# EAGLE schematic mother_card_cs_1159am (EAGLE 8.3.2)

## Sheet 1 of 2
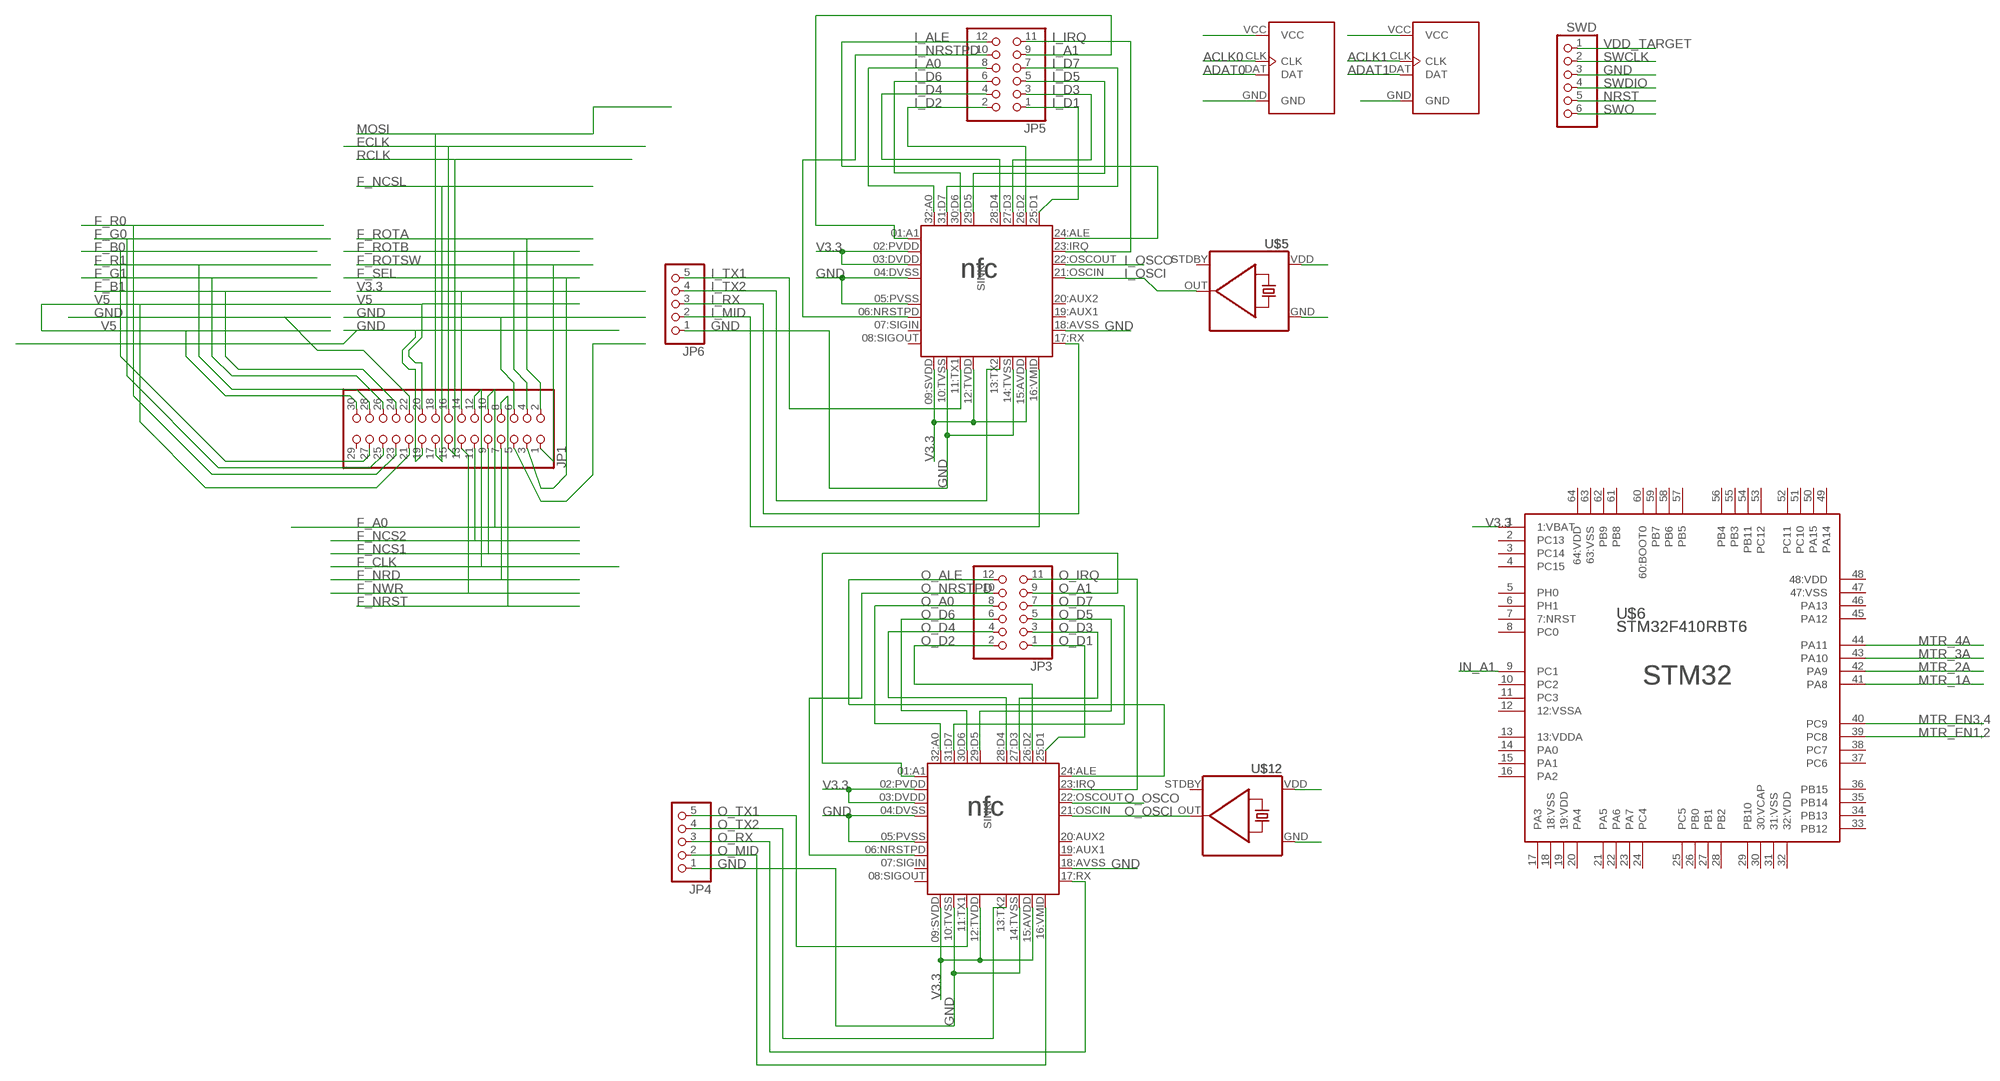
[diagram p0: schematic, sheet 1]

### Parts
JP1  PINHD-2X15/SOCK  [2X15/SOCK]
JP3  PINHD-2X6  [2X06]
JP4  PINHD-1X5  [1X05]
JP5  PINHD-2X6  [2X06]
JP6  PINHD-1X5  [1X05]
SWD  PINHD-1X6  [1X06]
U$1  HX711  [HX711]
U$2  HX711  [HX711]
U$3  PN215_NFC  [PN512_32_5X5]
U$5  DSC1033_27.12MHZ  [DSC1033_5X3.2]
U$6  STM32F410RBT6  [QFP50P1200X1200X160-64N]
U$11  PN215_NFC  [PN512_32_5X5]
U$12  DSC1033_27.12MHZ  [DSC1033_5X3.2]

### Nets
3V3B: JP1.5
ACLK0: U$1.CLK
ACLK1: U$2.CLK
ADAT0: U$1.DAT
ADAT1: U$2.DAT
ECLK: JP1.16
F_A0: JP1.10
F_B0: JP1.27
F_B1: JP1.24
F_CLK: JP1.12
F_G0: JP1.25
F_G1: JP1.26
F_NCS1: JP1.9
F_NCS2: JP1.11
F_NCSL: JP1.17
F_NRD: JP1.7
F_NRST: JP1.8
F_NWR: JP1.13
F_R0: JP1.23
F_R1: JP1.28
F_ROTA: JP1.2
F_ROTB: JP1.4
F_ROTSW: JP1.1
F_SEL: JP1.3
GND: JP1.6 JP1.19 JP1.22 JP6.1 SWD.3 U$3.04:DVSS U$3.05:PVSS U$3.10:TVSS U$3.14:TVSS U$3.18:AVSS U$5.GND U$11.04:DVSS U$11.05:PVSS U$11.10:TVSS U$11.14:TVSS U$11.18:AVSS U$12.GND ; also sheet 2
I_A0: JP5.8 U$11.32:A0
I_A1: JP5.9 U$11.01:A1
I_ALE: JP5.12 U$11.24:ALE
I_D1: JP5.1 U$11.25:D1
I_D2: JP5.2 U$11.26:D2
I_D3: JP5.3 U$11.27:D3
I_D4: JP5.4 U$11.28:D4
I_D5: JP5.5 U$11.29:D5
I_D6: JP5.6 U$11.30:D6
I_D7: JP5.7 U$11.31:D7
I_IRQ: JP5.11 U$11.23:IRQ
I_MID: JP6.2 U$11.16:VMID
I_NRSTPD: JP5.10 U$11.06:NRSTPD
I_OSCI: U$5.OUT(FO) U$11.21:OSCIN
I_OSCO: U$11.22:OSCOUT
I_RX: JP6.3 U$11.17:RX
I_TX1: JP6.5 U$11.11:TX1
I_TX2: JP6.4 U$11.13:TX2
IN_A1: U$6.9(PC1)
MOSI: JP1.18
MTR_1A: U$6.41(PA8) ; also sheet 2
MTR_2A: U$6.42(PA9) ; also sheet 2
MTR_3A: U$6.43(PA10) ; also sheet 2
MTR_4A: U$6.44(PA11) ; also sheet 2
MTR_EN1,2: U$6.39(PC8) ; also sheet 2
MTR_EN3,4: U$6.40(PC9) ; also sheet 2
N$6: U$1.GND
N$7: U$2.GND
N$8: U$2.VCC
N$9: U$1.VCC
NRST: SWD.5
O_A0: JP3.8 U$3.32:A0
O_A1: JP3.9 U$3.01:A1
O_ALE: JP3.12 U$3.24:ALE
O_D1: JP3.1 U$3.25:D1
O_D2: JP3.2 U$3.26:D2
O_D3: JP3.3 U$3.27:D3
O_D4: JP3.4 U$3.28:D4
O_D5: JP3.5 U$3.29:D5
O_D6: JP3.6 U$3.30:D6
O_D7: JP3.7 U$3.31:D7
O_IRQ: JP3.11 U$3.23:IRQ
O_MID: U$3.16:VMID
O_NRSTPD: JP3.10 U$3.06:NRSTPD
O_OSCI: U$3.21:OSCIN U$12.OUT(FO)
O_OSCO: U$3.22:OSCOUT
O_RX: U$3.17:RX
O_TX1: U$3.11:TX1
O_TX2: U$3.13:TX2
RCLK: JP1.15
SWCLK: SWD.2
SWDIO: SWD.4
SWO: SWD.6
V3.3: JP1.14 U$3.02:PVDD U$3.03:DVDD U$3.09:SVDD U$3.12:TVDD U$3.15:AVDD U$5.VDD(VCC) U$6.1(1:VBAT) U$11.02:PVDD U$11.03:DVDD U$11.09:SVDD U$11.12:TVDD U$11.15:AVDD U$12.VDD(VCC) ; also sheet 2
V5: JP1.20 JP1.21 JP1.30 ; also sheet 2
VDD_TARGET: SWD.1
Unconnected: JP1.29 JP4.1 JP4.2 JP4.3 JP4.4 JP4.5 U$3.07:SIGIN U$3.08:SIGOUT U$3.19:AUX1 U$3.20:AUX2 U$5.STDBY U$6.2(PC13) U$6.3(PC14) U$6.4(PC15) U$6.5(PH0) U$6.6(PH1) U$6.7(7:NRST) U$6.8(PC0) U$6.10(PC2) U$6.11(PC3) U$6.12(12:VSSA) U$6.13(13:VDDA) U$6.14(PA0) U$6.15(PA1) U$6.16(PA2) U$6.17(PA3) U$6.18(18:VSS) U$6.19(19:VDD) U$6.20(PA4) U$6.21(PA5) U$6.22(PA6) U$6.23(PA7) U$6.24(PC4) U$6.25(PC5) U$6.26(PB0) U$6.27(PB1) U$6.28(PB2) U$6.29(PB10) U$6.30(30:VCAP) U$6.31(31:VSS) U$6.32(32:VDD) U$6.33(PB12) U$6.34(PB13) U$6.35(PB14) U$6.36(PB15) U$6.37(PC6) U$6.38(PC7) U$6.45(PA12) U$6.46(PA13) U$6.47(47:VSS) U$6.48(48:VDD) U$6.49(PA14) U$6.50(PA15) U$6.51(PC10) U$6.52(PC11) U$6.53(PC12) U$6.54(PB11) U$6.55(PB3) U$6.56(PB4) U$6.57(PB5) U$6.58(PB6) U$6.59(PB7) U$6.60(60:BOOT0) U$6.61(PB8) U$6.62(PB9) U$6.63(63:VSS) U$6.64(64:VDD) U$11.07:SIGIN U$11.08:SIGOUT U$11.19:AUX1 U$11.20:AUX2 U$12.STDBY

## Sheet 2 of 2
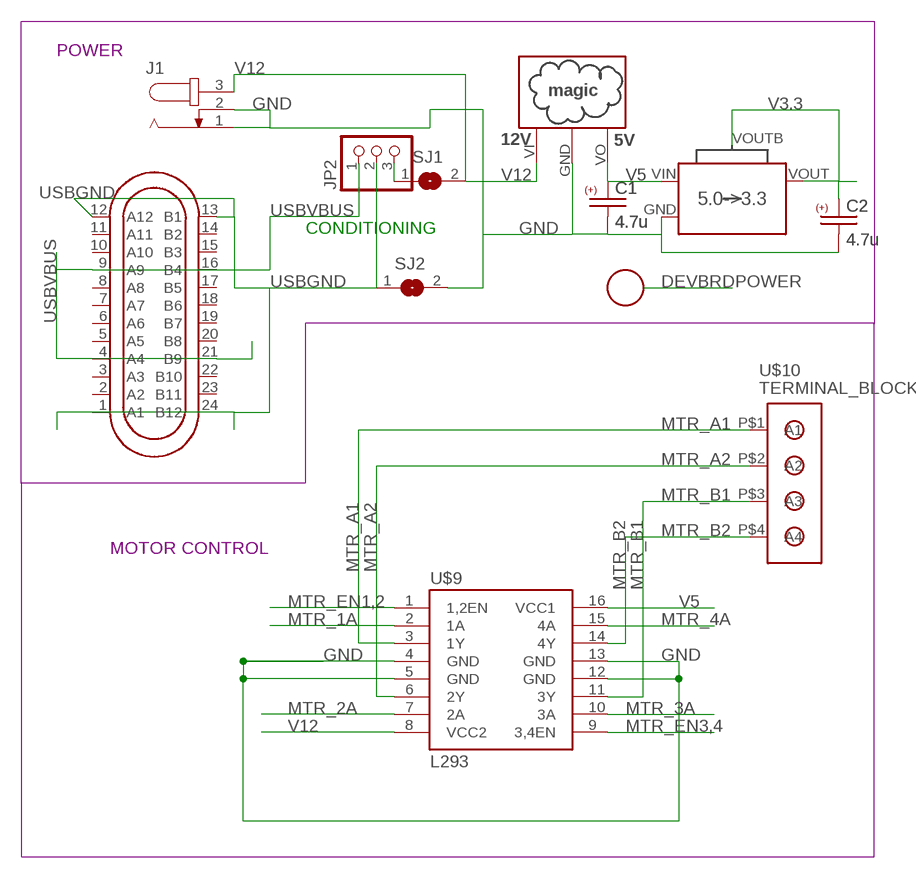
[diagram p1: schematic, sheet 2]

### Parts
C1  4.7u  C-USC0805  [C0805]
C2  4.7u  C-USC0805  [C0805]
J1  JACK-PLUG0  [SPC4077]
JP2  PINHD-1X3  [1X03]
SJ1  SJ  [SJ]
SJ2  SJ  [SJ]
U$4  OKI-78SR-W36  [SIP3]
U$7  USB-C-BRKOUT  [USB-C-BRKOUT]
U$8  AP2114H  [AP2114H]
U$9  L293  [DIL16]
U$10  TERMINAL_BLOCK  [1X4/BLOCK]

### Nets
GND: C1.2 C2.2 J1.1 J1.2 SJ2.2 U$4.GND U$8.GND U$9.4(GND) U$9.5(GND) U$9.12(GND) U$9.13(GND) ; also sheet 1
MTR_1A: U$9.2(1A) ; also sheet 1
MTR_2A: U$9.7(2A) ; also sheet 1
MTR_3A: U$9.10(3A) ; also sheet 1
MTR_4A: U$9.15(4A) ; also sheet 1
MTR_A1: U$9.3(1Y) U$10.P$1(A1)
MTR_A2: U$9.6(2Y) U$10.P$2(A2)
MTR_B1: U$9.11(3Y) U$10.P$3(A3)
MTR_B2: U$9.14(4Y) U$10.P$4(A4)
MTR_EN1,2: U$9.1(1,2EN) ; also sheet 1
MTR_EN3,4: U$9.9(3,4EN) ; also sheet 1
N$1: JP2.3 SJ1.1
USBGND: JP2.2 SJ2.1 U$7.1(A1) U$7.12(A12) U$7.13(B1) U$7.24(B12)
USBVBUS: JP2.1 U$7.4(A4) U$7.9(A9) U$7.16(B4) U$7.21(B9)
V3.3: C2.1 U$8.VOUT(VO) U$8.VOUTB(BODY) ; also sheet 1
V5: C1.1 U$4.VO U$8.VIN(VI) U$9.16(VCC1) ; also sheet 1
V12: J1.3 SJ1.2 U$4.VI U$9.8(VCC2)
Unconnected: U$7.2(A2) U$7.3(A3) U$7.5(A5) U$7.6(A6) U$7.7(A7) U$7.8(A8) U$7.10(A10) U$7.11(A11) U$7.14(B2) U$7.15(B3) U$7.17(B5) U$7.18(B6) U$7.19(B7) U$7.20(B8) U$7.22(B10) U$7.23(B11)

### Notes on the sheet
- POWER
- CONDITIONING
- MOTOR CONTROL

## Power pins joined to a net without a drawn wire
P$33: U$3.SINK U$11.SINK

## Library data of the parts
C1 C2 = seniorDesign:C-US: CAPACITOR, American symbol
J1 = con-jack:JACK-PLUG: DC POWER JACK Power Jack, DC, Right Angle, Through Hole, Rated 5A at 16VDC, PC Terminals Distributor: Farnell (www.Farnell.de) Drawing: 84N1161.pdf / 84N1162.pdf Manufacturer: SPC Technology (www.spctechnology.com) Type: SPC4077 / SPC 4078; OC_FARNELL: unknown; OC_NEWARK: unknown
JP1 = csomers:PINHD-2X15: PIN HEADER, socket for parallel cable, IDC connector, On Shore Technology Inc.
JP2 = pinhead:PINHD-1X3: PIN HEADER
JP3 JP5 = pinhead:PINHD-2X6: PIN HEADER
JP4 JP6 = pinhead:PINHD-1X5: PIN HEADER
SJ1 SJ2 = jumper:SJ: SMD solder JUMPER
SWD = pinhead:PINHD-1X6: PIN HEADER
U$1 U$2 = seniorDesign:HX711: old green circuit board rendition of HX711 load amplifier
U$3 U$11 = seniorDesign:PN215_NFC: NXP USA Inc. PN5120A0HN1/C2,151 nfc chip, mother board https://media.digikey.com/pdf/Data%20Sheets/NXP%20PDFs/PN512.pdf
U$4 = seniorDesign:OKI-78SR-W36
U$5 U$12 = seniorDesign:DSC1033_27.12MHZ: Microchip Technology DSC1033BI2-027.1200 mother board nfc oscillator for stability http://ww1.microchip.com/.../DSC1033%20Datasheet%20MKQBPD0318091-7.pdf <http://ww1.microchip.com/downloads/en/DeviceDoc/DSC1033%20Datasheet%20MKQBPD0318091-7.pdf>
U$6 = seniorDesign:STM32F410RBT6: STMicroelectronics STM32F410RBT6 main microcontroller, motherboard http://www.st.com/.../content/translations/en.DM00214043.pdf <http://www.st.com/content/ccc/resource/technical/document/datasheet/6e/f3/b0/1b/05/eb/49/fe/DM00214043.pdf/files/DM00214043.pdf/jcr:content/translations/en.DM00214043.pdf>
U$7 = usb:USB-C-BRKOUT
U$8 = seniorDesign:AP2114: AP2114H-3.3TRG1DICT-ND 5V LDO, main 5V line, motherboard https://www.diodes.com/assets/Datasheets/AP2114.pdf
U$9 = seniorDesign:L293: L293 Stepper Motor Driver
U$10 = seniorDesign:TERMINAL_BLOCK: Terminal Block for stepper motor connections